# Altium project Window.PrjPcb
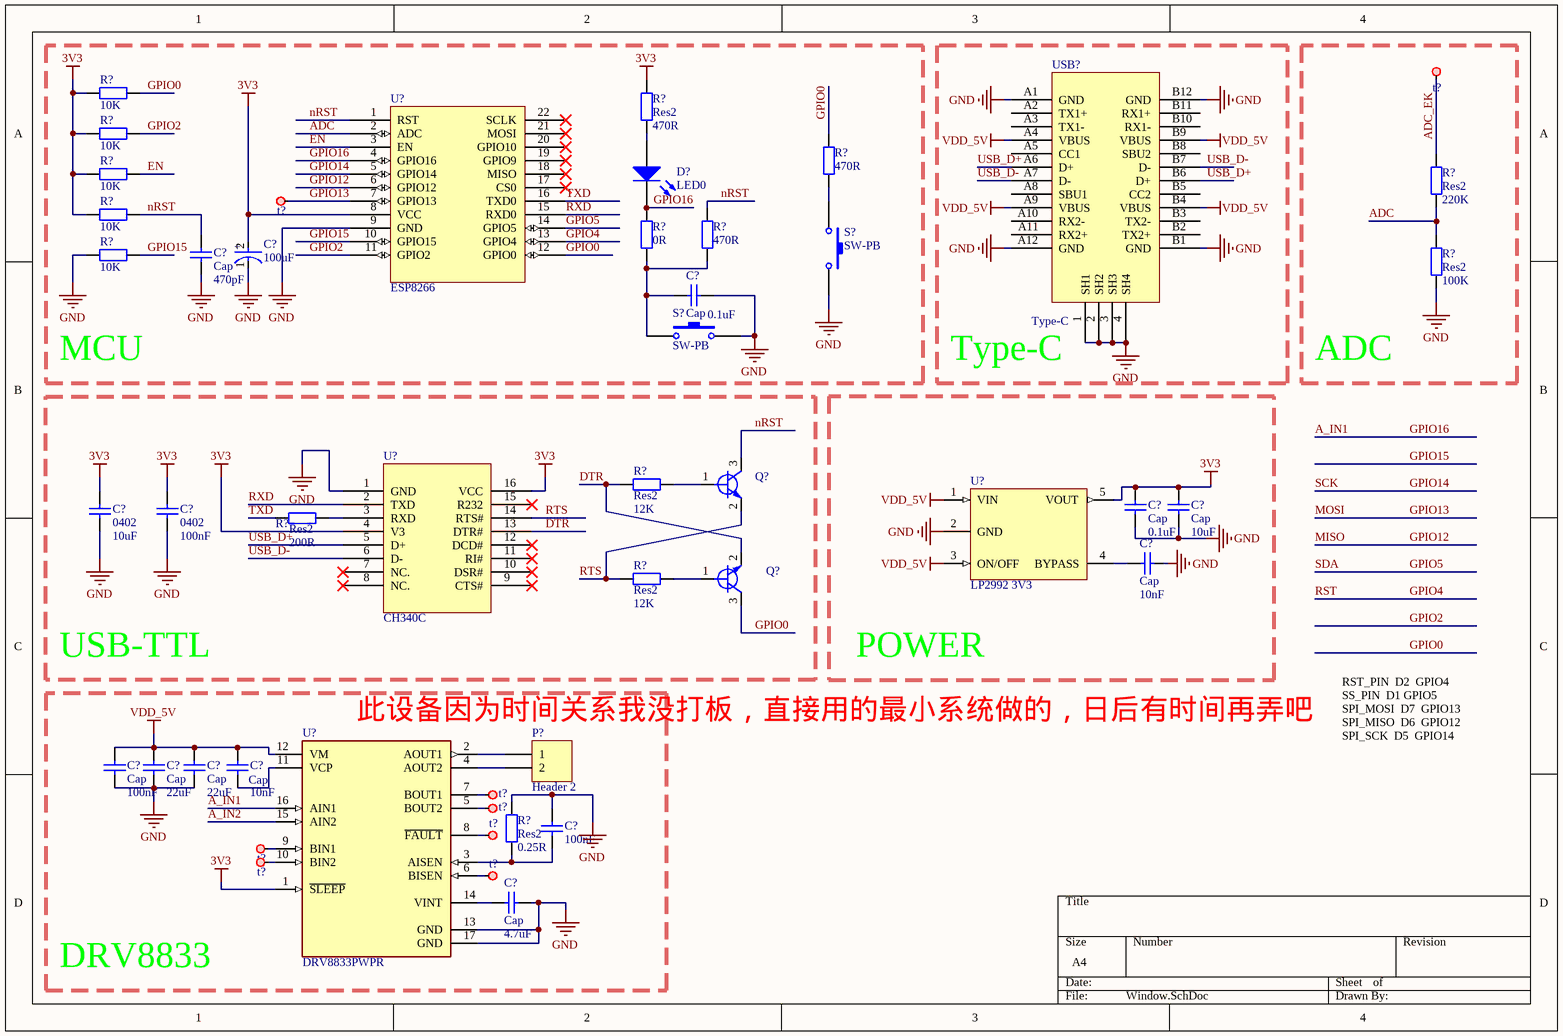
[diagram p0: Window.SchDoc]
1 sheet, 48 parts. Net scope: global (net labels, ports and power ports of the same name join across sheets).

## Sheet Window.SchDoc
size A4

### Parts
(Parts that share a designator on the sheet are numbered #1, #2 ... from top to bottom, then left to right.)
C?#1  100uF  [FP-T495D107K016ATE125-MFG]
C?#2  Cap  value 470pF  [C 0402_M]
C?#3  Cap  value 0.1uF  [C 0402_M]
C?#4  Cap  value 0.1uF  [C 0402_M]
C?#5  Cap  value 10uF  [C 0402_M]
C?#6  0402  value 10uF  [C 0402_M]
C?#7  0402  value 100nF  [C 0402_M]
C?#8  Cap  value 10nF  [C 0402_M]
C?#9  Cap  value 100nF  [C 0402_M]
C?#10  Cap  value 22uF  [C 0402_M]
C?#11  Cap  value 22uF  [C 0402_M]
C?#12  Cap  value 10nF  [C 0402_M]
C?#13  value 100nF  [C 0402_M]
C?#14  Cap  value 4.7uF  [C 0402_M]
D?  LED0  [LED 0603R]
P?  Header 2  [HDR1X2]
Q?#1  Y1 NPN SOT23-3  [SMT_TRIODE_NPN]  (value not drawn)
Q?#2  Y1 NPN SOT23-3  [SMT_TRIODE_NPN]  (value not drawn)
R?#1  value 10K  [R 0402_M]  (hidden comment: 0402)
R?#2  Res2  value 470R  [R 0402_M]
R?#3  value 10K  [R 0402_M]  (hidden comment: 0402)
R?#4  value 10K  [R 0402_M]  (hidden comment: 0402)
R?#5  Res2  value 220K  [R 0402_M]
R?#6  value 470R  [R 0402_M]  (hidden comment: Res2)
R?#7  value 10K  [R 0402_M]  (hidden comment: 0402)
R?#8  value 10K  [R 0402_M]  (hidden comment: 0402)
R?#9  value 0R  [R 0402_M]  (hidden comment: Res2)
R?#10  value 470R  [R 0402_M]  (hidden comment: Res2)
R?#11  Res2  value 100K  [R 0402_M]
R?#12  Res2  value 12K  [R 0402_M]
R?#13  Res2  value 200R  [R 0402_M]
R?#14  Res2  value 12K  [R 0402_M]
R?#15  Res2  value 0.25R  [R 1206_M]
S?#1  SW-PB  [TSW DIP-6*6*5]
S?#2  SW-PB  [TSW DIP-6*6*5]
t?#1  test  [test]  (value not drawn)
t?#2  test  [test]  (value not drawn)
t?#3  test  [test]  (value not drawn)
t?#4  test  [test]  (value not drawn)
t?#5  test  [test]  (value not drawn)
t?#6  test  [test]  (value not drawn)
t?#7  test  [test]  (value not drawn)
t?#8  test  [test]  (value not drawn)
U?#1  ESP8266  [esp8266]
U?#2  LP2992 3V3  [SOT23-5N]
U?#3  CH340C  [CH340]
U?#4  DRV8833PWPR  [FP-PWP0016C-IPC_A]
USB?  Type-C  [Type-C-TOP]

### Blocks framed on the sheet
MCU: C?#1-C?#3 D? R?#1-R?#4 R?#6-R?#10 S?#1 S?#2 t?#2 U?#1
Type-C: USB?
ADC: R?#5 R?#11 t?#1
USB-TTL: C?#6 C?#7 Q?#1 Q?#2 R?#12-R?#14 U?#3
POWER: C?#4 C?#5 C?#8 U?#2
DRV8833: C?#9-C?#14 P? R?#15 t?#3-t?#8 U?#4

### Nets
3V3: C?#1.2(A) C?#4.1 C?#5.1 C?#6.2 C?#7.2 R?#1.1 R?#2.1 R?#3.1 R?#4.1 R?#7.1 U?#1.8(VCC) U?#2.5(VOUT) U?#3.4(V3) U?#3.16(VCC) U?#4.1(~{SLEEP})
GND: C?#1.1(C) C?#2.2 C?#3.2 C?#4.2 C?#5.2 C?#6.1 C?#7.1 C?#8.2 C?#9.2 C?#10.2 C?#11.2 C?#13.2 C?#14.1 R?#8.1 R?#11.2 R?#15.2 S?#1.2 S?#2.2 U?#1.9(GND) U?#2.2(GND) U?#3.1(GND) U?#4.13(GND) U?#4.17(GND) USB?.1(SH1) USB?.2(SH2) USB?.3(SH3) USB?.4(SH4) USB?.A1(GND) USB?.A12(GND) USB?.B1(GND) USB?.B12(GND)
VDD_5V: C?#9.1 C?#10.1 C?#11.1 C?#12.2 U?#2.1(VIN) U?#2.3(ON/OFF) U?#4.12(VM) USB?.A4(VBUS) USB?.A9(VBUS) USB?.B4(VBUS) USB?.B9(VBUS)
A_IN1: D?.2(K) R?#9.2 U?#1.4(GPIO16) U?#4.16(AIN1)  [also labelled GPIO16]
A_IN2: U?#4.15(AIN2)
ADC: R?#5.2 R?#11.1 U?#1.2(ADC)
ADC_EK: R?#5.1 t?#1.1(test)
DTR: Q?#2.2(EMITTER) R?#12.1 U?#3.13(DTR#)
EN: R?#4.2 U?#1.3(EN)
GPIO0: Q?#2.3(COLLECTOR) R?#1.2 R?#6.2 U?#1.12(GPIO0)
GPIO2: R?#3.2 U?#1.11(GPIO2)
GPIO4: U?#1.13(GPIO4)  [also labelled RST]
GPIO5: U?#1.14(GPIO5)  [also labelled SDA]
GPIO12: U?#1.6(GPIO12)  [also labelled MISO]
GPIO13: t?#2.1(test) U?#1.7(GPIO13)  [also labelled MOSI]
GPIO14: U?#1.5(GPIO14)  [also labelled SCK]
GPIO15: R?#8.2 U?#1.10(GPIO15)
nRST: C?#2.1 Q?#1.3(COLLECTOR) R?#7.2 R?#10.2 U?#1.1(RST)
RTS: Q?#1.2(EMITTER) R?#14.1 U?#3.14(RTS#)
RXD: U?#1.15(RXD0) U?#3.2(TXD)
TXD: R?#13.1 U?#1.16(TXD0)
USB_D+: U?#3.5(D+) USB?.A6(D+) USB?.B6(D+)
USB_D-: U?#3.6(D-) USB?.A7(D-) USB?.B7(D-)
NetC?#3_1: C?#3.1 R?#9.1 R?#10.1 S?#2.1
NetC?#8_1: C?#8.1 U?#2.4(BYPASS)
NetC?#12_1: C?#12.1 U?#4.11(VCP)
NetC?#13_1: C?#13.1 R?#15.1 U?#4.3(AISEN)
NetC?#14_2: C?#14.2 U?#4.14(VINT)
NetD?_1: D?.1(A) R?#2.2
NetP?_1: P?.1 U?#4.2(AOUT1)
NetP?_2: P?.2 U?#4.4(AOUT2)
NetQ?#1_1: Q?#1.1(BASE) R?#12.2
NetQ?#2_1: Q?#2.1(BASE) R?#14.2
NetR?#6_1: R?#6.1 S?#1.1
NetR?#13_2: R?#13.2 U?#3.3(RXD)
Nett?#3_1: t?#3.1(test) U?#4.7(BOUT1)
Nett?#4_1: t?#4.1(test) U?#4.5(BOUT2)
Nett?#5_1: t?#5.1(test) U?#4.8(~{FAULT})
Nett?#6_1: t?#6.1(test) U?#4.9(BIN1)
Nett?#7_1: t?#7.1(test) U?#4.10(BIN2)
Nett?#8_1: t?#8.1(test) U?#4.6(BISEN)

Not connected (* = marked no-connect by the designer): U?#1 17(CS0)* 18(MISO)* 19(GPIO9)* 20(GPIO10)* 21(MOSI)* 22(SCLK)*; U?#3 7(NC.)* 8(NC.)* 9(CTS#)* 10(DSR#)* 11(RI#)* 12(DCD#)* 15(R232)*; USB? A2(TX1+) A3(TX1-) A5(CC1) A8(SBU1) A10(RX2-) A11(RX2+) B2(TX2+) B3(TX2-) B5(CC2) B8(SBU2) B10(RX1-) B11(RX1+)

### Notes on the sheet
- 此设备因为时间关系我没打板，直接用的最小系统做的，日后有时间再弄吧
- RST_PIN  D2  GPIO4
  SS_PIN  D1 GPIO5
  SPI_MOSI  D7  GPIO13
  SPI_MISO  D6  GPIO12
  SPI_SCK  D5  GPIO14
- (in symbol CMP-2000-07207-2) +

### Library data of the parts
C?#1 = CMP-2000-07207-2: CAP TANT 100UF 10% 16V 2917; Life (Hours): 2000Hour; ESR (Equivalent Series Resistance): 125mR; Polarity: Polar; Dielectric Material: Tantalum; Dissipation Factor: 8%; Capacitance: 100uF; Radiation Hardening: No; RoHS Compliant: Yes; Length: 7.3mm; Features: General Purpose; Packaging: Tape and Reel; Package Quantity: 1; Weight: 0.023634oz; Voltage Rating: 16V; Width: 0.169inch; Case/Package: 2917; Mount: Surface Mount; Voltage: 16V; Min Operating Temperature: -55°C; Tolerance: 10%; REACH SVHC: No SVHC; Height - Seated (Max): 0.122inch; Number of Pins: 2; Construction: Flat; Depth: 4.3mm; Series: T495; Max Operating Temperature: 125°C; Failure Rate: 0.001%; Termination: SMD/SMT; Voltage Rating (DC): 16V; Case Code (Imperial): 2917; Case Code (Metric): 7343; Height: 2.8mm
C?#2-C?#14 = Cap Semi: Capacitor (Semiconductor SIM Model); Published: 8-Jun-2000; LatestRevisionDate: 29-May-2009; LatestRevisionNote: IPC-7351 Footprint Added.; PackageReference: C1206; Publisher: Altium Limited; PackageDescription: Chip Capacitor
D? = LED0: Typical INFRARED GaAs LED; Published: 8-Jun-2000; LatestRevisionDate: 08-Jul-2005; LatestRevisionNote: Mech Layer 1 removed.; PackageReference: LED-0; Publisher: Altium Limited; PackageDescription: LED; 2 Leads
P? = Header 2: Header, 2-Pin; LatestRevisionDate: 17-Jul-2002; LatestRevisionNote: Re-released for DXP Platform.; Publisher: Altium Limited
Q?#1 Q?#2 = S8050
R?#1-R?#15 = Res2: Resistor; Published: 8-Jun-2000; LatestRevisionDate: 17-Jul-2002; LatestRevisionNote: Re-released for DXP Platform.; PackageReference: AXIAL-0.4; Publisher: Altium Limited; PackageDescription: Axial Device, Thru-Hole; 2 Leads; 0.4 in Pin Spacing
S?#1 S?#2 = SW-PB: Switch; Published: 24-Mar-1999; LatestRevisionDate: 17-Jul-2002; LatestRevisionNote: Re-released for DXP Platform.; PackageReference: SPST-2; Publisher: Altium Limited; PackageDescription: Switch; 2 Leads
U?#2 = LP2992: LDO
U?#4 = CMP-1529-00004-3: IC MOTOR DRIVER PAR 16HTSSOP; Supply Current: 3mA; Max Output Current: 2A; Interface: PWM; Output Current: 1.5A; Max Supply Voltage: 10.8V; Fault Protection: Over Temperature; Number of Outputs: 2; Min Supply Voltage: 2.7V; Nominal Supply Current: 3mA; Series: DRV8833; Min Operating Temperature: -40°C; Package Quantity: 2000; Packaging: Tape and Reel; Case/Package: HTSSOP; Output Current per Channel: 1.5A; RoHS Compliant: Yes; RMS Current (Irms): 1.5A; Max Operating Temperature: 85°C; Technology: NMOS; Number of Pins: 16; Radiation Hardening: No; Lead Free: Lead Free; REACH SVHC: No SVHC
USB? = USB-Type-C-TOP